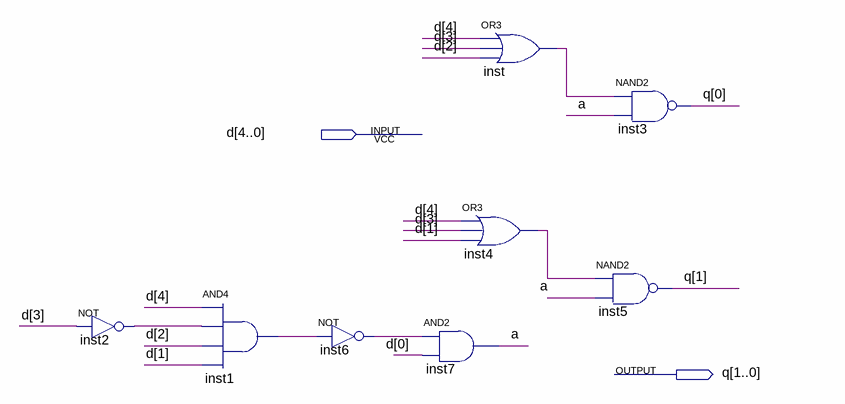
[diagram p0: schematic sheet]
// Quartus schematic decoded.bdf as structural Verilog: 8 symbols, 2 pins
module decoded (
  input  [4:0] d,
  output [1:0] q
);

  wire a, inst1_out, inst2_out, inst4_out, inst6_out, inst_out;

  not inst2 (inst2_out, d[3]);
  and inst1 (inst1_out, d[4], inst2_out, d[2], d[1]);
  not inst6 (inst6_out, inst1_out);
  and inst7 (a, inst6_out, d[0]);
  or inst (inst_out, d[4], d[3], d[2]);
  or inst4 (inst4_out, d[4], d[3], d[1]);
  nand inst3 (q[0], inst_out, a);
  nand inst5 (q[1], inst4_out, a);
endmodule
